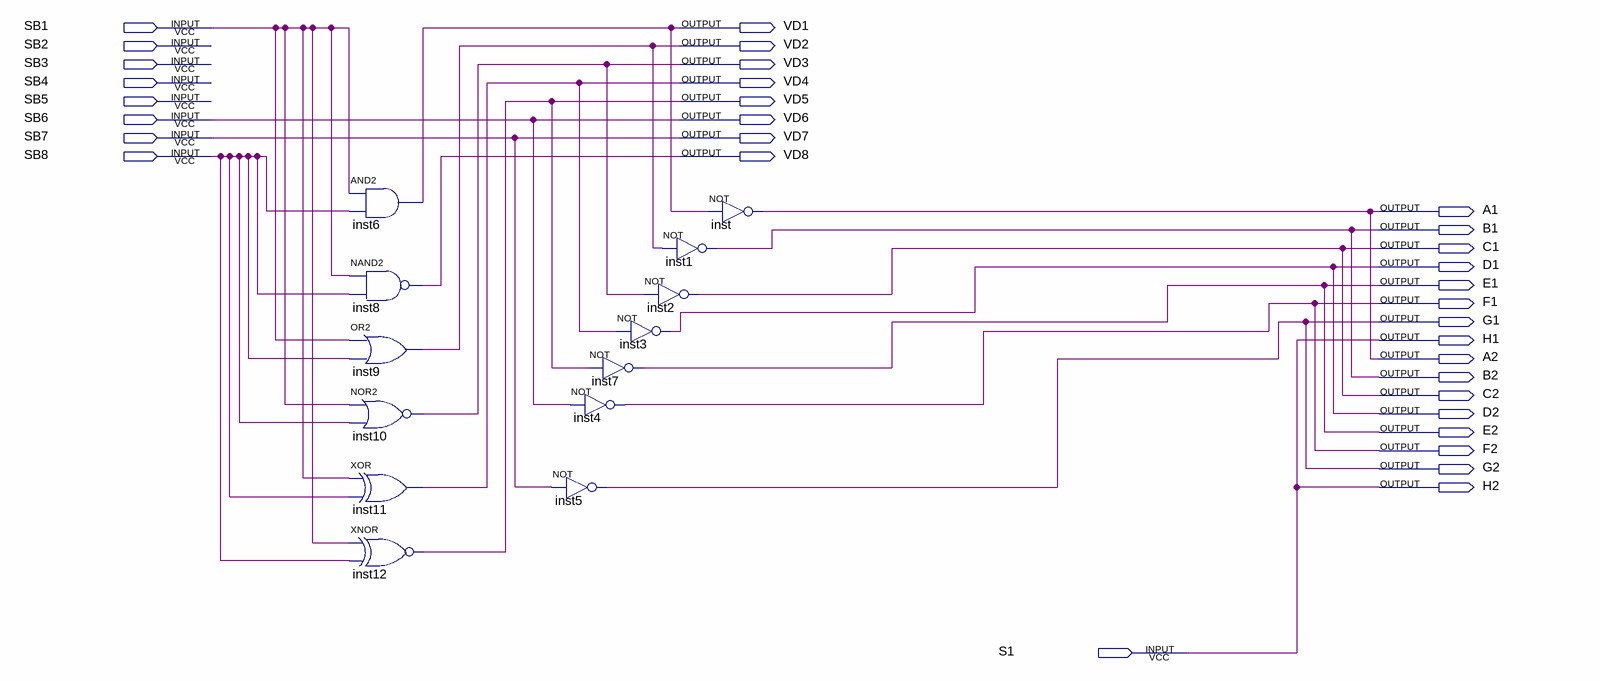
[diagram p0: schematic sheet]
// Quartus schematic Mark2.bdf as structural Verilog: 13 symbols, 33 pins
module Mark2 (
  input  SB1,
  input  SB2,
  input  SB3,
  input  SB4,
  input  SB5,
  input  SB6,
  input  SB7,
  input  SB8,
  input  S1,
  output VD1,
  output VD2,
  output VD3,
  output VD4,
  output VD5,
  output VD6,
  output VD7,
  output VD8,
  output A1,
  output B1,
  output C1,
  output D1,
  output E1,
  output F1,
  output G1,
  output H1,
  output A2,
  output B2,
  output C2,
  output D2,
  output E2,
  output F2,
  output G2,
  output H2
);

  and inst6 (VD1, SB1, SB8);
  nand inst8 (VD8, SB1, SB8);
  or inst9 (VD2, SB1, SB8);
  nor inst10 (VD3, SB1, SB8);
  xor inst11 (VD4, SB1, SB8);
  xnor inst12 (VD5, SB1, SB8);
  not inst4 (F1, SB6);
  not inst5 (G1, SB7);
  not inst2 (C1, VD3);
  not inst3 (D1, VD4);
  not inst7 (E1, VD5);
  not inst (A1, VD1);
  not inst1 (B1, VD2);

  assign A2 = A1;
  assign B2 = B1;
  assign C2 = C1;
  assign D2 = D1;
  assign E2 = E1;
  assign F2 = F1;
  assign G2 = G1;
  assign H1 = S1;
  assign H2 = S1;
  assign VD6 = SB6;
  assign VD7 = SB7;
endmodule
